# Altium project LaserControl.PrjPCB
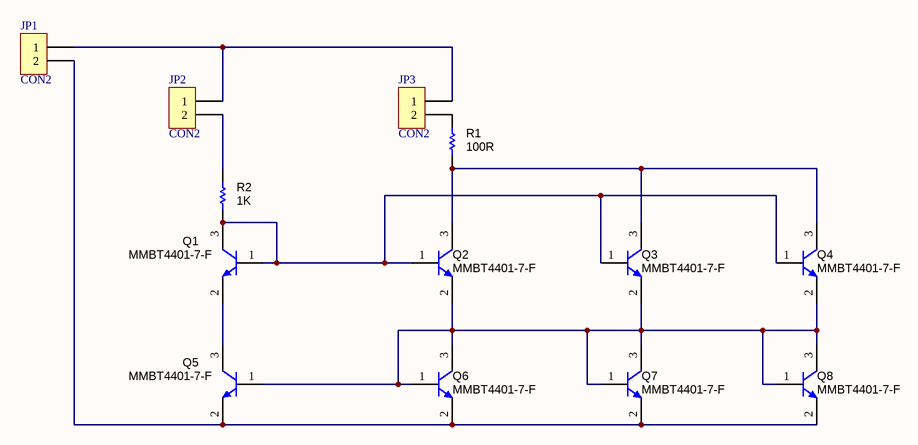
[diagram p0: LaserControl.SchDoc]
1 sheet, 13 parts. Net scope: global (net labels, ports and power ports of the same name join across sheets).
Board file: LaserControl.PcbDoc

## Sheet LaserControl.SchDoc
size A

### Parts
JP1  CON2  [SIP2]
JP2  CON2  [SIP2]
JP3  CON2  [SIP2]
Q1  MMBT4401-7-F  [SOT-23]
Q2  MMBT4401-7-F  [SOT-23]
Q3  MMBT4401-7-F  [SOT-23]
Q4  MMBT4401-7-F  [SOT-23]
Q5  MMBT4401-7-F  [SOT-23]
Q6  MMBT4401-7-F  [SOT-23]
Q7  MMBT4401-7-F  [SOT-23]
Q8  MMBT4401-7-F  [SOT-23]
R1  100R  [0603]
R2  1K  [0603]

### Nets
NetJP1_1: JP1.1 JP2.1 JP3.1
NetJP1_2: JP1.2 Q5.2(E) Q6.2(E) Q7.2(E) Q8.2(E)
NetJP2_2: JP2.2 R2.1
NetJP3_2: JP3.2 R1.1
NetQ1_1: Q1.1(B) Q1.3(C) Q2.1(B) Q3.1(B) Q4.1(B) R2.2
NetQ1_2: Q1.2(E) Q5.3(C)
NetQ2_2: Q2.2(E) Q3.2(E) Q4.2(E) Q5.1(B) Q6.1(B) Q6.3(C) Q7.1(B) Q7.3(C) Q8.1(B) Q8.3(C)
NetQ2_3: Q2.3(C) Q3.3(C) Q4.3(C) R1.2

### Library data of the parts
JP1-JP3 = CON2: Connector
Q1-Q8 = MMBT4401-7-F, Diodes Inc.: Transistor, NPN, 40 V, 0.15 A, SOT-23; CompType: BJT; PNP: 0; NPN: 1; Vceo_V: 40; Vcesat1_V: 0.4; Value: 40 V; IcRated_A: 0.15; Value1: 0.15 A; HfeMax: 300; TaMin_C: -55; TaMax_C: 150; U/M: EA; AEC Category: Q101; SymbolVersion: 2008-07-31; PartNumber: MMBT4401-7-F; Manufacturer: Diodes Inc.; PackageReference: SOT-23; RoHS: Y; Value2: 300; Published: 2008-07-31; LatestRevisionDate: 2016-06-12; Publisher: Texas Instruments; ComponentLink1Description: Datasheet link; ComponentLink1URL: http://www.diodes.com/datasheets/ds30039.pdf; Supplier 1: Digi-Key; Supplier Part Number 1: MMBT4401-FDICT-ND; Supplier 2: Farnell; Supplier Part Number 2: 2061459; MountType: SMT; AEC Qualified: ?
R1 R2 = RC0603FR-07180RL: Manufacturer: Yageo America; CompType: Resistor; Value: 180; Value_Code: 180R; Tolerance_%: 1; Value1: 1%; Power_W: 0.1; Value2: 0.1W; VDC_V: 150; TempCo: 200 ppm/C; SizeArea_mm2: 1.28; SizeX_mm: 1.6; SizeY_mm: 0.8; U/M: EA; AEC Category: Q200; SymbolVersion: 2009-05-29; PartNumber: RC0603FR-07180RL; ValueDisplayed: 180; PackageReference: 0603; RoHS: Y; Res_ohm: 180; MountType: SMT; Technology: Thick Film; SizeZ_mm: 1; Published: 2008-06-26; Publisher: Texas Instruments; LatestRevisionDate: 2016-11-02; ComponentLink1Description: Datasheet link; ComponentLink1URL: http://www.yageo.com/pdf/Pu-RC0603_51_PbFree_L_2.pdf; Supplier 1: Digi-Key; Supplier Part Number 1: 311-180HRCT-ND; Supplier 2: Mouser; Supplier Part Number 2: 603-RC0603FR-07180RL; Supplier 3: Farnell; Supplier Part Number 3: 9238395; AEC Qualified: ?